# EAGLE design untitled (EAGLE 9.5.0)
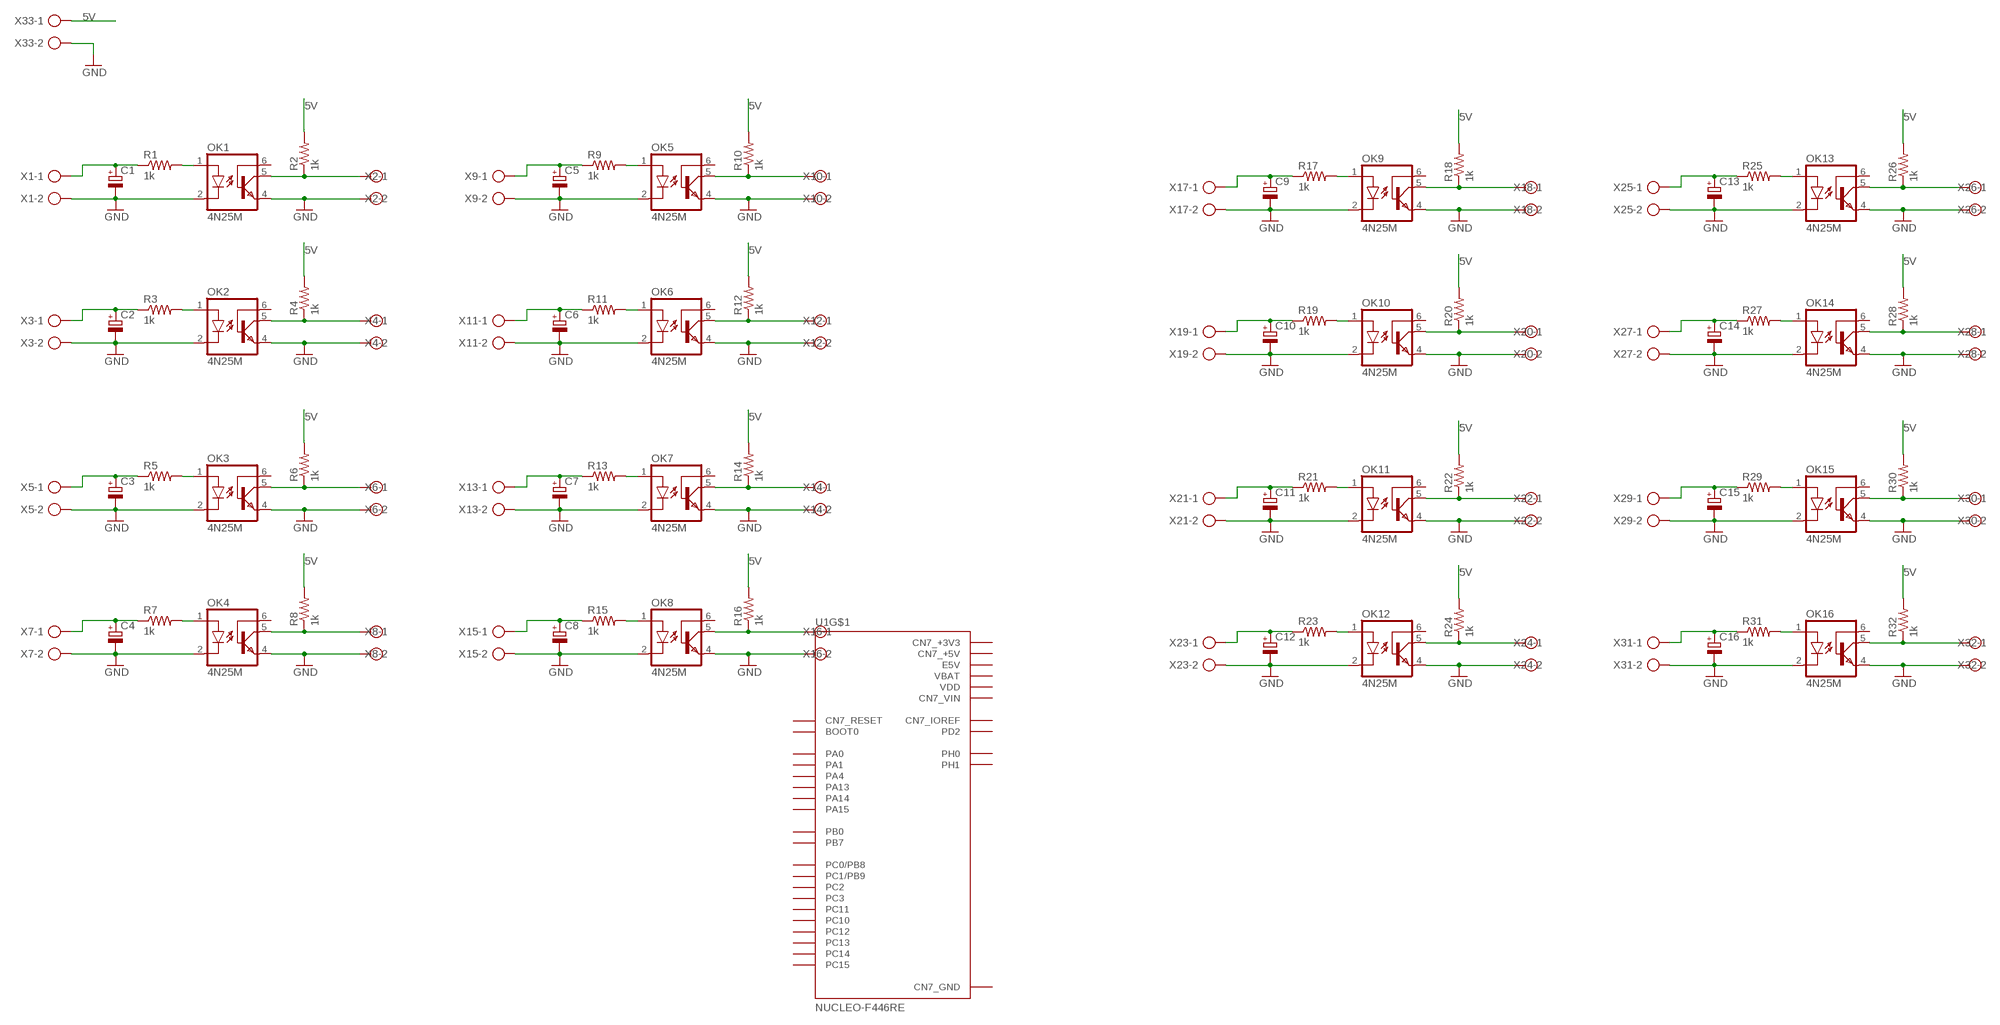
[diagram p0: schematic, sheet 1]

## Parts
C1  CPOL-EUE2.5-5  [E2,5-5]
C2  CPOL-EUE2.5-5  [E2,5-5]
C3  CPOL-EUE2.5-5  [E2,5-5]
C4  CPOL-EUE2.5-5  [E2,5-5]
C5  CPOL-EUE2.5-5  [E2,5-5]
C6  CPOL-EUE2.5-5  [E2,5-5]
C7  CPOL-EUE2.5-5  [E2,5-5]
C8  CPOL-EUE2.5-5  [E2,5-5]
C9  CPOL-EUE2.5-5  [E2,5-5]
C10  CPOL-EUE2.5-5  [E2,5-5]
C11  CPOL-EUE2.5-5  [E2,5-5]
C12  CPOL-EUE2.5-5  [E2,5-5]
C13  CPOL-EUE2.5-5  [E2,5-5]
C14  CPOL-EUE2.5-5  [E2,5-5]
C15  CPOL-EUE2.5-5  [E2,5-5]
C16  CPOL-EUE2.5-5  [E2,5-5]
OK1  4N25M  [DIL06]
OK2  4N25M  [DIL06]
OK3  4N25M  [DIL06]
OK4  4N25M  [DIL06]
OK5  4N25M  [DIL06]
OK6  4N25M  [DIL06]
OK7  4N25M  [DIL06]
OK8  4N25M  [DIL06]
OK9  4N25M  [DIL06]
OK10  4N25M  [DIL06]
OK11  4N25M  [DIL06]
OK12  4N25M  [DIL06]
OK13  4N25M  [DIL06]
OK14  4N25M  [DIL06]
OK15  4N25M  [DIL06]
OK16  4N25M  [DIL06]
R1  1k  R-US_0207/10  [0207/10]
R2  1k  R-US_0207/10  [0207/10]
R3  1k  R-US_0207/10  [0207/10]
R4  1k  R-US_0207/10  [0207/10]
R5  1k  R-US_0207/10  [0207/10]
R6  1k  R-US_0207/10  [0207/10]
R7  1k  R-US_0207/10  [0207/10]
R8  1k  R-US_0207/10  [0207/10]
R9  1k  R-US_0207/10  [0207/10]
R10  1k  R-US_0207/10  [0207/10]
R11  1k  R-US_0207/10  [0207/10]
R12  1k  R-US_0207/10  [0207/10]
R13  1k  R-US_0207/10  [0207/10]
R14  1k  R-US_0207/10  [0207/10]
R15  1k  R-US_0207/10  [0207/10]
R16  1k  R-US_0207/10  [0207/10]
R17  1k  R-US_0207/10  [0207/10]
R18  1k  R-US_0207/10  [0207/10]
R19  1k  R-US_0207/10  [0207/10]
R20  1k  R-US_0207/10  [0207/10]
R21  1k  R-US_0207/10  [0207/10]
R22  1k  R-US_0207/10  [0207/10]
R23  1k  R-US_0207/10  [0207/10]
R24  1k  R-US_0207/10  [0207/10]
R25  1k  R-US_0207/10  [0207/10]
R26  1k  R-US_0207/10  [0207/10]
R27  1k  R-US_0207/10  [0207/10]
R28  1k  R-US_0207/10  [0207/10]
R29  1k  R-US_0207/10  [0207/10]
R30  1k  R-US_0207/10  [0207/10]
R31  1k  R-US_0207/10  [0207/10]
R32  1k  R-US_0207/10  [0207/10]
U1  NUCLEO-F446RE  [MODULE_NUCLEO-F446RE]
X1  AK300/2  [AK300/2]
X2  AK300/2  [AK300/2]
X3  AK300/2  [AK300/2]
X4  AK300/2  [AK300/2]
X5  AK300/2  [AK300/2]
X6  AK300/2  [AK300/2]
X7  AK300/2  [AK300/2]
X8  AK300/2  [AK300/2]
X9  AK300/2  [AK300/2]
X10  AK300/2  [AK300/2]
X11  AK300/2  [AK300/2]
X12  AK300/2  [AK300/2]
X13  AK300/2  [AK300/2]
X14  AK300/2  [AK300/2]
X15  AK300/2  [AK300/2]
X16  AK300/2  [AK300/2]
X17  AK300/2  [AK300/2]
X18  AK300/2  [AK300/2]
X19  AK300/2  [AK300/2]
X20  AK300/2  [AK300/2]
X21  AK300/2  [AK300/2]
X22  AK300/2  [AK300/2]
X23  AK300/2  [AK300/2]
X24  AK300/2  [AK300/2]
X25  AK300/2  [AK300/2]
X26  AK300/2  [AK300/2]
X27  AK300/2  [AK300/2]
X28  AK300/2  [AK300/2]
X29  AK300/2  [AK300/2]
X30  AK300/2  [AK300/2]
X31  AK300/2  [AK300/2]
X32  AK300/2  [AK300/2]
X33  AK300/2  [AK300/2]

## Nets
5V: R2.2 R4.2 R6.2 R8.2 R10.2 R12.2 R14.2 R16.2 R18.2 R20.2 R22.2 R24.2 R26.2 R28.2 R30.2 R32.2 X33.1
GND: C1.- C2.- C3.- C4.- C5.- C6.- C7.- C8.- C9.- C10.- C11.- C12.- C13.- C14.- C15.- C16.- OK1.2(C) OK1.4(EMI) OK2.2(C) OK2.4(EMI) OK3.2(C) OK3.4(EMI) OK4.2(C) OK4.4(EMI) OK5.2(C) OK5.4(EMI) OK6.2(C) OK6.4(EMI) OK7.2(C) OK7.4(EMI) OK8.2(C) OK8.4(EMI) OK9.2(C) OK9.4(EMI) OK10.2(C) OK10.4(EMI) OK11.2(C) OK11.4(EMI) OK12.2(C) OK12.4(EMI) OK13.2(C) OK13.4(EMI) OK14.2(C) OK14.4(EMI) OK15.2(C) OK15.4(EMI) OK16.2(C) OK16.4(EMI) X1.2 X2.2 X3.2 X4.2 X5.2 X6.2 X7.2 X8.2 X9.2 X10.2 X11.2 X12.2 X13.2 X14.2 X15.2 X16.2 X17.2 X18.2 X19.2 X20.2 X21.2 X22.2 X23.2 X24.2 X25.2 X26.2 X27.2 X28.2 X29.2 X30.2 X31.2 X32.2 X33.2
N$1: OK1.1(A) R1.2
N$2: OK2.1(A) R3.2
N$3: C2.+ R3.1 X3.1
N$4: OK2.5(COL) R4.1 X4.1
N$5: OK3.1(A) R5.2
N$6: C3.+ R5.1 X5.1
N$7: OK3.5(COL) R6.1 X6.1
N$8: OK4.1(A) R7.2
N$9: C4.+ R7.1 X7.1
N$10: OK4.5(COL) R8.1 X8.1
N$11: OK5.1(A) R9.2
N$12: C5.+ R9.1 X9.1
N$13: OK5.5(COL) R10.1 X10.1
N$14: OK6.1(A) R11.2
N$15: C1.+ R1.1 X1.1
N$16: C6.+ R11.1 X11.1
N$17: OK1.5(COL) R2.1 X2.1
N$18: OK6.5(COL) R12.1 X12.1
N$19: OK7.1(A) R13.2
N$20: C7.+ R13.1 X13.1
N$21: OK7.5(COL) R14.1 X14.1
N$22: OK8.1(A) R15.2
N$23: C8.+ R15.1 X15.1
N$24: OK8.5(COL) R16.1 X16.1
N$25: OK9.1(A) R17.2
N$26: C9.+ R17.1 X17.1
N$27: OK9.5(COL) R18.1 X18.1
N$28: OK10.1(A) R19.2
N$29: C10.+ R19.1 X19.1
N$30: OK10.5(COL) R20.1 X20.1
N$31: OK11.1(A) R21.2
N$32: C11.+ R21.1 X21.1
N$33: OK11.5(COL) R22.1 X22.1
N$34: OK12.1(A) R23.2
N$35: C12.+ R23.1 X23.1
N$36: OK12.5(COL) R24.1 X24.1
N$37: OK13.1(A) R25.2
N$38: C13.+ R25.1 X25.1
N$39: OK13.5(COL) R26.1 X26.1
N$40: OK14.1(A) R27.2
N$41: C14.+ R27.1 X27.1
N$42: OK14.5(COL) R28.1 X28.1
N$43: OK15.1(A) R29.2
N$44: C15.+ R29.1 X29.1
N$45: OK15.5(COL) R30.1 X30.1
N$46: OK16.1(A) R31.2
N$47: C16.+ R31.1 X31.1
N$48: OK16.5(COL) R32.1 X32.1
Unconnected: OK1.6(BAS) OK2.6(BAS) OK3.6(BAS) OK4.6(BAS) OK5.6(BAS) OK6.6(BAS) OK7.6(BAS) OK8.6(BAS) OK9.6(BAS) OK10.6(BAS) OK11.6(BAS) OK12.6(BAS) OK13.6(BAS) OK14.6(BAS) OK15.6(BAS) OK16.6(BAS) U1.CN5_1(D8) U1.CN5_2(D9) U1.CN5_3(D10) U1.CN5_4(D11) U1.CN5_5(D12) U1.CN5_6(D13) U1.CN5_9(D14) U1.CN5_10(D15) U1.CN6_2(CN6_IOREF) U1.CN6_3(CN6_RESET) U1.CN7_1(PC10) U1.CN7_2(PC11) U1.CN7_3(PC12) U1.CN7_4(PD2) U1.CN7_7(BOOT0) U1.CN7_12(CN7_IOREF) U1.CN7_13(PA13) U1.CN7_14(CN7_RESET) U1.CN7_15(PA14) U1.CN7_17(PA15) U1.CN7_21(PB7) U1.CN7_23(PC13) U1.CN7_25(PC14) U1.CN7_27(PC15) U1.CN7_28(PA0) U1.CN7_29(PH0) U1.CN7_30(PA1) U1.CN7_31(PH1) U1.CN7_32(PA4) U1.CN7_34(PB0) U1.CN7_35(PC2) U1.CN7_36(PC1/PB9) U1.CN7_37(PC3) U1.CN7_38(PC0/PB8) U1.CN8_1(A0) U1.CN8_2(A1) U1.CN8_3(A2) U1.CN8_4(A3) U1.CN8_5(A4) U1.CN8_6(A5) U1.CN9_1(D0) U1.CN9_2(D1) U1.CN9_3(D2) U1.CN9_4(D3) U1.CN9_5(D4) U1.CN9_6(D5) U1.CN9_7(D6) U1.CN9_8(D7) U1.CN10_1(PC9) U1.CN10_2(PC8) U1.CN10_3(PB8) U1.CN10_4(PC6) U1.CN10_5(PB9) U1.CN10_6(PC5) U1.CN10_11(PA5) U1.CN10_12(PA12) U1.CN10_13(PA6) U1.CN10_14(PA11) U1.CN10_15(PA7) U1.CN10_16(PB12) U1.CN10_17(PB6) U1.CN10_19(PC7) U1.CN10_21(PA9) U1.CN10_22(PB2) U1.CN10_23(PA8) U1.CN10_24(PB1) U1.CN10_25(PB10) U1.CN10_26(PB15) U1.CN10_27(PB4) U1.CN10_28(PB14) U1.CN10_29(PB5) U1.CN10_30(PB13) U1.CN10_31(PB3) U1.CN10_33(PA10) U1.CN10_34(PC4) U1.CN10_35(PA2) U1.CN10_37(PA3)

## Power pins joined to a net without a drawn wire
AGND: U1.CN10_32(AGND)
AREF: U1.CN5_8(AREF)
AVDD: U1.CN10_7(AVDD)
CN5_GND: U1.CN5_7(CN5_GND)
CN6_+3V3: U1.CN6_4(CN6_+3V3)
CN6_+5V: U1.CN6_5(CN6_+5V)
CN6_GND: U1.CN6_6(CN6_GND) U1.CN6_7(CN6_GND)
CN6_VIN: U1.CN6_8(CN6_VIN)
CN7_+3V3: U1.CN7_16(CN7_+3V3)
CN7_+5V: U1.CN7_18(CN7_+5V)
CN7_GND: U1.CN7_8(CN7_GND) U1.CN7_19(CN7_GND) U1.CN7_20(CN7_GND) U1.CN7_22(CN7_GND)
CN7_VIN: U1.CN7_24(CN7_VIN)
CN10_GND: U1.CN10_9(CN10_GND) U1.CN10_20(CN10_GND)
E5V: U1.CN7_6(E5V)
U5V: U1.CN10_8(U5V)
VBAT: U1.CN7_33(VBAT)
VDD: U1.CN7_5(VDD)

## Library data of the parts
C1-C16 = rcl:CPOL-EU: POLARIZED CAPACITOR, European symbol; SPICEPREFIX: C
OK1-OK16 = optocoupler:4N*?M: General Purpose 6-Pin Phototransistor Optocouplers Source: http://www.fairchildsemi.com/ds/4N/4N35-M.pdf; MPN: 4N25-M; OC_FARNELL: 1021349; OC_NEWARK: 98K9084
R1-R32 = rcl:R-US_: RESISTOR, American symbol; SPICEPREFIX: R
U1 = NUCLEO-F446RE:NUCLEO-F446RE: STM32 Nucleo-64 development board with STM32F446RET6 MCU, supports Arduino and ST morpho connectivity Check prices <https://pricing.snapeda.com/parts/NUCLEO-F446RE/STMicroelectronics/view-part?ref=eda>; AVAILABILITY: Warning; DESCRIPTION: STM32F446RE, mbed-Enabled Development Nucleo-64 STM32F4 ARM® Cortex®-M4 MCU 32-Bit Embedded Evaluation Board; MF: STMicroelectronics; MP: NUCLEO-F446RE; PACKAGE: None; PRICE: None; PURCHASE-URL: https://pricing.snapeda.com/search/part/NUCLEO-F446RE/?ref=eda
X1-X33 = con-ptr500:AK300/2: CONNECTOR; OC_FARNELL: unknown; OC_NEWARK: unknown

## Board
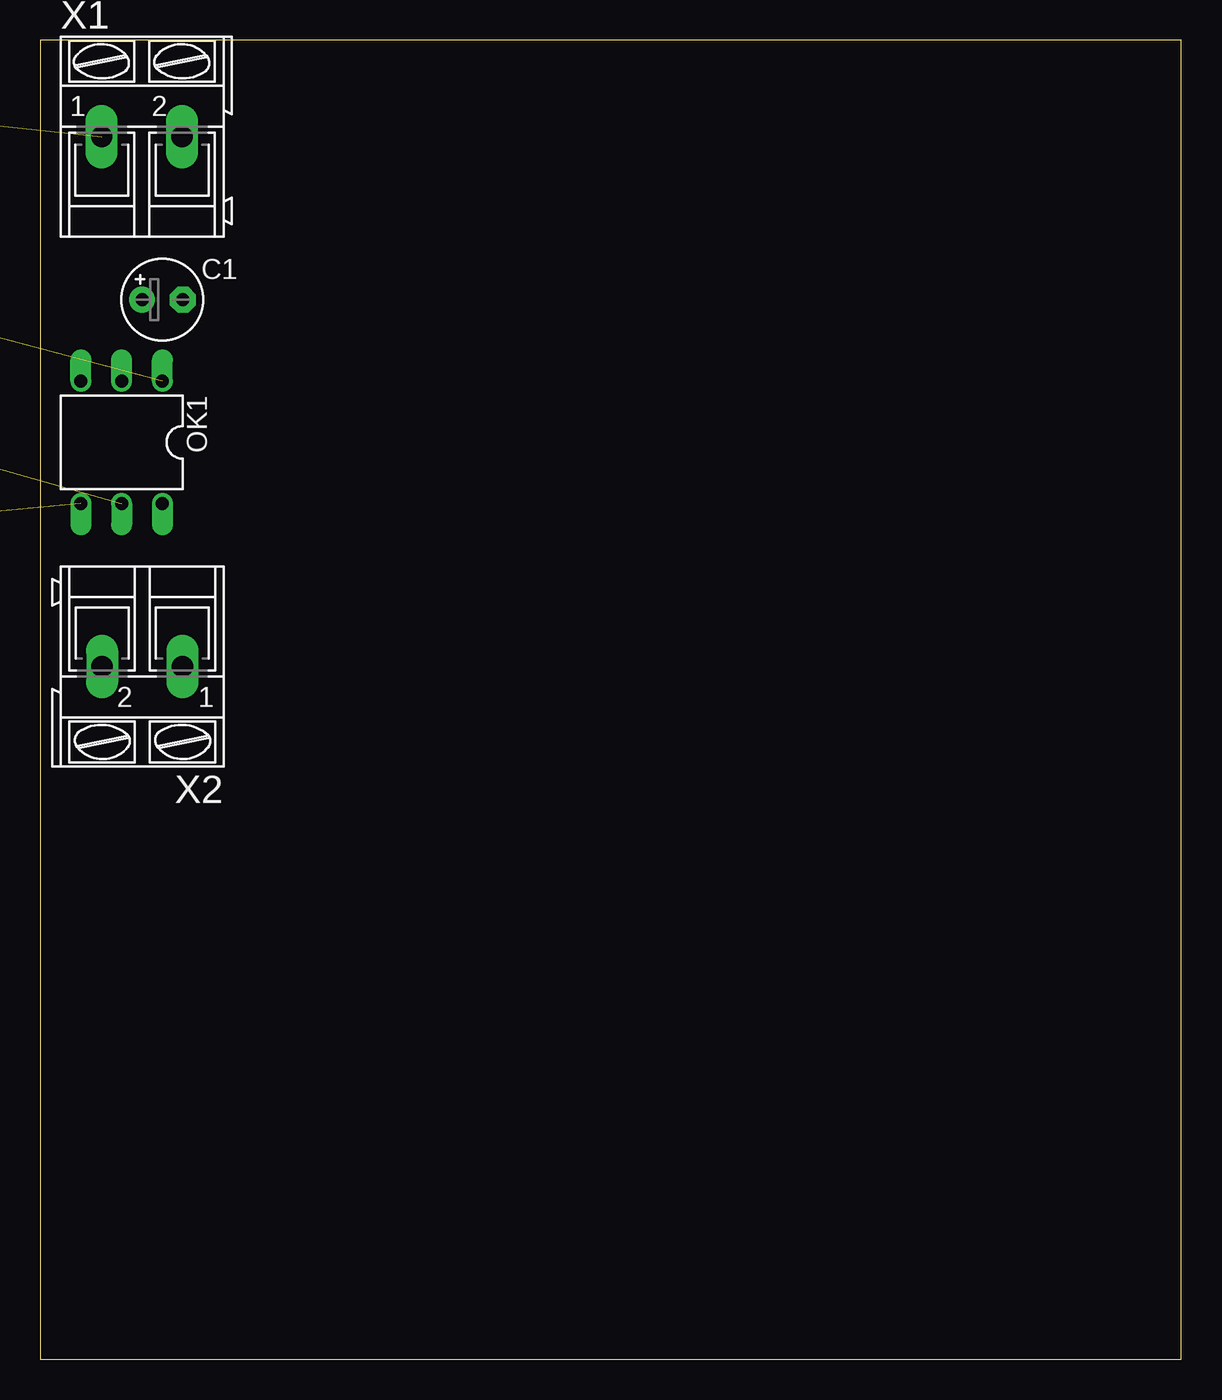
[diagram p1: board, top side]
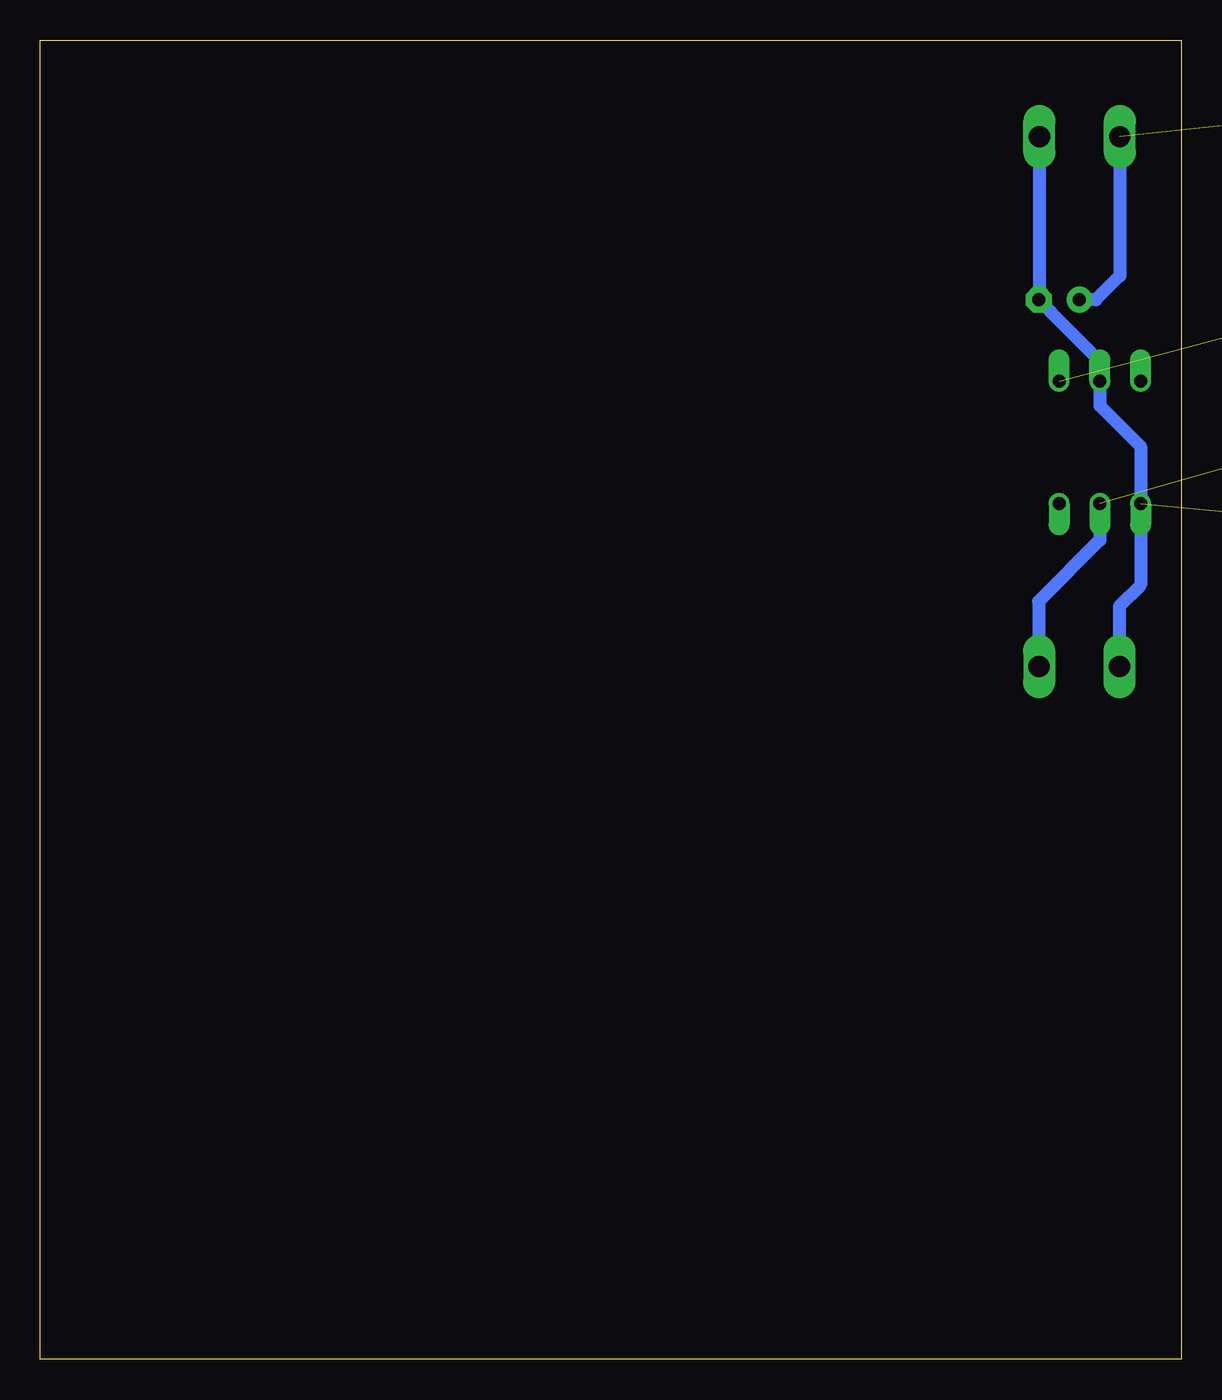
[diagram p2: board, bottom side, seen from below]

Size 71.1 x 82.22 mm. Coordinates in mm from the lower left corner, seen from the top.
Outline: 0,0 71.1,0 71.1,82.22 0,82.22 0,0
Copper layers (1*16): Top 0.035mm / dielectric 1.5mm / Bottom 0.035mm
Design rules "default": minimum track width 6mil, minimum drill 0.35mm, track to track 24mil, track to pad 24mil, pad to pad 24mil, via to via 24mil, smd to smd 24mil, copper to edge 40mil, drill to drill 6mil, minimum pad ring 10mil, minimum via ring 8mil, stop-mask expansion 4mil, vias tented up to drill 0mil, thermal gap 10mil

### Footprints (pad centres in the part's own frame; a part is rotated, then mirrored left to right if it is on the bottom)
E2,5-5 = drill 0.813 pad 1.6: + -1.27,0 | drill 0.813 pad 1.6 octagon: - 1.27,0
DIL06 = drill 0.813 offset: 1 -2.54,-3.81; 2 0,-3.81; 3 2.54,-3.81; 4 2.54,3.81; 5 0,3.81; 6 -2.54,3.81
0207/10 = drill 0.813 pad 2.184 octagon: 1 -5.08,0; 2 5.08,0
MODULE_NUCLEO-F446RE = drill 1.07 square: CN5_1 24.13,-14.37; CN6_1 -24.13,-0.65; CN8_1 -24.13,-23.51; CN9_1 24.13,-36.21 | drill 1.07: CN5_2 24.13,-11.83; CN5_3 24.13,-9.29; CN5_4 24.13,-6.75; CN5_5 24.13,-4.21; CN5_6 24.13,-1.67; CN5_7 24.13,0.87; CN5_8 24.13,3.41; CN5_9 24.13,5.95; CN5_10 24.13,8.49; CN6_2 -24.13,-3.19; CN6_3 -24.13,-5.73; CN6_4 -24.13,-8.27; CN6_5 -24.13,-10.81; CN6_6 -24.13,-13.35; CN6_7 -24.13,-15.89; CN6_8 -24.13,-18.43; CN8_2 -24.13,-26.05; CN8_3 -24.13,-28.59; CN8_4 -24.13,-31.13; CN8_5 -24.13,-33.67; CN8_6 -24.13,-36.21; CN9_2 24.13,-33.67; CN9_3 24.13,-31.13; CN9_4 24.13,-28.59; CN9_5 24.13,-26.05; CN9_6 24.13,-23.51; CN9_7 24.13,-20.97; CN9_8 24.13,-18.43 | drill 1.02 square: CN7_1 -31.75,9.51; CN10_1 29.21,9.51 | drill 1.02: CN7_2 -29.21,9.51; CN7_3 -31.75,6.97; CN7_4 -29.21,6.97; CN7_5 -31.75,4.43; CN7_6 -29.21,4.43; CN7_7 -31.75,1.89; CN7_8 -29.21,1.89; CN7_9 -31.75,-0.65; CN7_10 -29.21,-0.65; CN7_11 -31.75,-3.19; CN7_12 -29.21,-3.19; CN7_13 -31.75,-5.73; CN7_14 -29.21,-5.73; CN7_15 -31.75,-8.27; CN7_16 -29.21,-8.27; CN7_17 -31.75,-10.81; CN7_18 -29.21,-10.81; CN7_19 -31.75,-13.35; CN7_20 -29.21,-13.35; CN7_21 -31.75,-15.89; CN7_22 -29.21,-15.89; CN7_23 -31.75,-18.43; CN7_24 -29.21,-18.43; CN7_25 -31.75,-20.97; CN7_26 -29.21,-20.97; CN7_27 -31.75,-23.51; CN7_28 -29.21,-23.51; CN7_29 -31.75,-26.05; CN7_30 -29.21,-26.05; CN7_31 -31.75,-28.59; CN7_32 -29.21,-28.59; CN7_33 -31.75,-31.13; CN7_34 -29.21,-31.13; CN7_35 -31.75,-33.67; CN7_36 -29.21,-33.67; CN7_37 -31.75,-36.21; CN7_38 -29.21,-36.21; CN10_2 31.75,9.51; CN10_3 29.21,6.97; CN10_4 31.75,6.97; CN10_5 29.21,4.43; CN10_6 31.75,4.43; CN10_7 29.21,1.89; CN10_8 31.75,1.89; CN10_9 29.21,-0.65; CN10_10 31.75,-0.65; CN10_11 29.21,-3.19; CN10_12 31.75,-3.19; CN10_13 29.21,-5.73; CN10_14 31.75,-5.73; CN10_15 29.21,-8.27; CN10_16 31.75,-8.27; CN10_17 29.21,-10.81; CN10_18 31.75,-10.81; CN10_19 29.21,-13.35; CN10_20 31.75,-13.35; CN10_21 29.21,-15.89; CN10_22 31.75,-15.89; CN10_23 29.21,-18.43; CN10_24 31.75,-18.43; CN10_25 29.21,-20.97; CN10_26 31.75,-20.97; CN10_27 29.21,-23.51; CN10_28 31.75,-23.51; CN10_29 29.21,-26.05; CN10_30 31.75,-26.05; CN10_31 29.21,-28.59; CN10_32 31.75,-28.59; CN10_33 29.21,-31.13; CN10_34 31.75,-31.13; CN10_35 29.21,-33.67; CN10_36 31.75,-33.67; CN10_37 29.21,-36.21; CN10_38 31.75,-36.21 | hole 3: 8.89,-38.75; 24.13,12.05; -24.13,13.32
AK300/2 = drill 1.321 long: 1 -2.515,0; 2 2.489,0

### Placement (x,y rotation side)
C1  7.62,66.04 0 top
C2  -26.67,88.9 0 top  (outside the outline)
C3  -35.56,88.9 0 top  (outside the outline)
C4  -44.45,88.9 0 top  (outside the outline)
C5  -53.34,88.9 0 top  (outside the outline)
C6  -62.23,88.9 0 top  (outside the outline)
C7  -71.12,88.9 0 top  (outside the outline)
C8  -80.01,88.9 0 top  (outside the outline)
C9  -88.9,88.9 0 top  (outside the outline)
C10  -58.42,76.2 0 top  (outside the outline)
C11  -111.76,76.2 0 top  (outside the outline)
C12  -67.31,76.2 0 top  (outside the outline)
C13  -76.2,76.2 0 top  (outside the outline)
C14  -85.09,76.2 0 top  (outside the outline)
C15  -93.98,76.2 0 top  (outside the outline)
C16  -102.87,76.2 0 top  (outside the outline)
OK1  5.08,57.15 180 top
OK2  -104.14,50.8 0 top  (outside the outline)
OK3  -114.3,50.8 0 top  (outside the outline)
OK4  -25.4,67.31 0 top  (outside the outline)
OK5  -35.56,67.31 0 top  (outside the outline)
OK6  -45.72,67.31 0 top  (outside the outline)
OK7  -55.88,67.31 0 top  (outside the outline)
OK8  -66.04,67.31 0 top  (outside the outline)
OK9  -76.2,67.31 0 top  (outside the outline)
OK10  -86.36,67.31 0 top  (outside the outline)
OK11  -96.52,67.31 0 top  (outside the outline)
OK12  -106.68,67.31 0 top  (outside the outline)
OK13  -116.84,67.31 0 top  (outside the outline)
OK14  -25.4,80.01 0 top  (outside the outline)
OK15  -35.56,80.01 0 top  (outside the outline)
OK16  -45.72,80.01 0 top  (outside the outline)
R1  -97.79,87.63 0 top  (outside the outline)
R2  -110.49,87.63 0 top  (outside the outline)
R3  -26.67,93.98 0 top  (outside the outline)
R4  -39.37,93.98 0 top  (outside the outline)
R5  -52.07,93.98 0 top  (outside the outline)
R6  -64.77,93.98 0 top  (outside the outline)
R7  -77.47,93.98 0 top  (outside the outline)
R8  -90.17,93.98 0 top  (outside the outline)
R9  -102.87,93.98 0 top  (outside the outline)
R10  -115.57,93.98 0 top  (outside the outline)
R11  -26.67,99.06 0 top  (outside the outline)
R12  -39.37,99.06 0 top  (outside the outline)
R13  -52.07,99.06 0 top  (outside the outline)
R14  -64.77,99.06 0 top  (outside the outline)
R15  -77.47,99.06 0 top  (outside the outline)
R16  -90.17,99.06 0 top  (outside the outline)
R17  -102.87,99.06 0 top  (outside the outline)
R18  -115.57,99.06 0 top  (outside the outline)
R19  -26.67,104.14 0 top  (outside the outline)
R20  -39.37,104.14 0 top  (outside the outline)
R21  -52.07,104.14 0 top  (outside the outline)
R22  -64.77,104.14 0 top  (outside the outline)
R23  -77.47,104.14 0 top  (outside the outline)
R24  -90.17,104.14 0 top  (outside the outline)
R25  -102.87,104.14 0 top  (outside the outline)
R26  -115.57,104.14 0 top  (outside the outline)
R27  -26.67,109.22 0 top  (outside the outline)
R28  -39.37,109.22 0 top  (outside the outline)
R29  -52.07,109.22 0 top  (outside the outline)
R30  -64.77,109.22 0 top  (outside the outline)
R31  -77.47,109.22 0 top  (outside the outline)
R32  -90.17,109.22 0 top  (outside the outline)
U1  187.96,57.15 0 top  (outside the outline)
X1  6.35,76.2 0 top
X2  6.35,43.18 180 top
X3  -49.53,1.27 0 top  (outside the outline)
X4  -60.96,1.27 0 top  (outside the outline)
X5  -72.39,1.27 0 top  (outside the outline)
X6  -83.82,1.27 0 top  (outside the outline)
X7  -95.25,1.27 0 top  (outside the outline)
X8  -106.68,1.27 0 top  (outside the outline)
X9  -118.11,1.27 0 top  (outside the outline)
X10  -26.67,17.78 0 top  (outside the outline)
X11  -38.1,17.78 0 top  (outside the outline)
X12  -49.53,17.78 0 top  (outside the outline)
X13  -60.96,17.78 0 top  (outside the outline)
X14  -72.39,17.78 0 top  (outside the outline)
X15  -83.82,17.78 0 top  (outside the outline)
X16  -95.25,17.78 0 top  (outside the outline)
X17  -106.68,17.78 0 top  (outside the outline)
X18  -118.11,17.78 0 top  (outside the outline)
X19  -26.67,34.29 0 top  (outside the outline)
X20  -38.1,34.29 0 top  (outside the outline)
X21  -49.53,34.29 0 top  (outside the outline)
X22  -60.96,34.29 0 top  (outside the outline)
X23  -72.39,34.29 0 top  (outside the outline)
X24  -83.82,34.29 0 top  (outside the outline)
X25  -95.25,34.29 0 top  (outside the outline)
X26  -106.68,34.29 0 top  (outside the outline)
X27  -118.11,34.29 0 top  (outside the outline)
X28  -26.67,50.8 0 top  (outside the outline)
X29  -38.1,50.8 0 top  (outside the outline)
X30  -49.53,50.8 0 top  (outside the outline)
X31  -60.96,50.8 0 top  (outside the outline)
X32  -72.39,50.8 0 top  (outside the outline)
X33  -83.82,50.8 0 top  (outside the outline)

### Tracks (layer width: path | path; a pad name or v marks a point on that pad's centre or on a via)
5V  (16 unrouted)
CN6_GND  (1 unrouted)
CN7_GND  (3 unrouted)
CN10_GND  (1 unrouted)
GND  (76 unrouted)
  Bottom 0.813: X1.2 8.84,66.09 C1.- 8.17,65.32 8.17,65.29 5.08,62.2 OK1.2 5.08,59.44 2.54,56.9 OK1.4 2.54,48.26 3.86,46.94 X2.2
N$1  (1 unrouted)
N$2  (1 unrouted)
N$3  (2 unrouted)
N$4  (2 unrouted)
N$5  (1 unrouted)
N$6  (2 unrouted)
N$7  (2 unrouted)
N$8  (1 unrouted)
N$9  (2 unrouted)
N$10  (2 unrouted)
N$11  (1 unrouted)
N$12  (2 unrouted)
N$13  (2 unrouted)
N$14  (1 unrouted)
N$15  (1 unrouted)
  Bottom 0.813: X1.1 3.83,67.54 5.33,66.04 C1.+
N$16  (2 unrouted)
N$17  (1 unrouted)
  Bottom 0.813: OK1.5 5.08,51.05 8.89,47.24 8.89,43.2 X2.1
N$18  (2 unrouted)
N$19  (1 unrouted)
N$20  (2 unrouted)
N$21  (2 unrouted)
N$22  (1 unrouted)
N$23  (2 unrouted)
N$24  (2 unrouted)
N$25  (1 unrouted)
N$26  (2 unrouted)
N$27  (2 unrouted)
N$28  (1 unrouted)
N$29  (2 unrouted)
N$30  (2 unrouted)
N$31  (1 unrouted)
N$32  (2 unrouted)
N$33  (2 unrouted)
N$34  (1 unrouted)
N$35  (2 unrouted)
N$36  (2 unrouted)
N$37  (1 unrouted)
N$38  (2 unrouted)
N$39  (2 unrouted)
N$40  (1 unrouted)
N$41  (2 unrouted)
N$42  (2 unrouted)
N$43  (1 unrouted)
N$44  (2 unrouted)
N$45  (2 unrouted)
N$46  (1 unrouted)
N$47  (2 unrouted)
N$48  (2 unrouted)